# EAGLE schematic ProMini-connection (EAGLE 8.1.0)
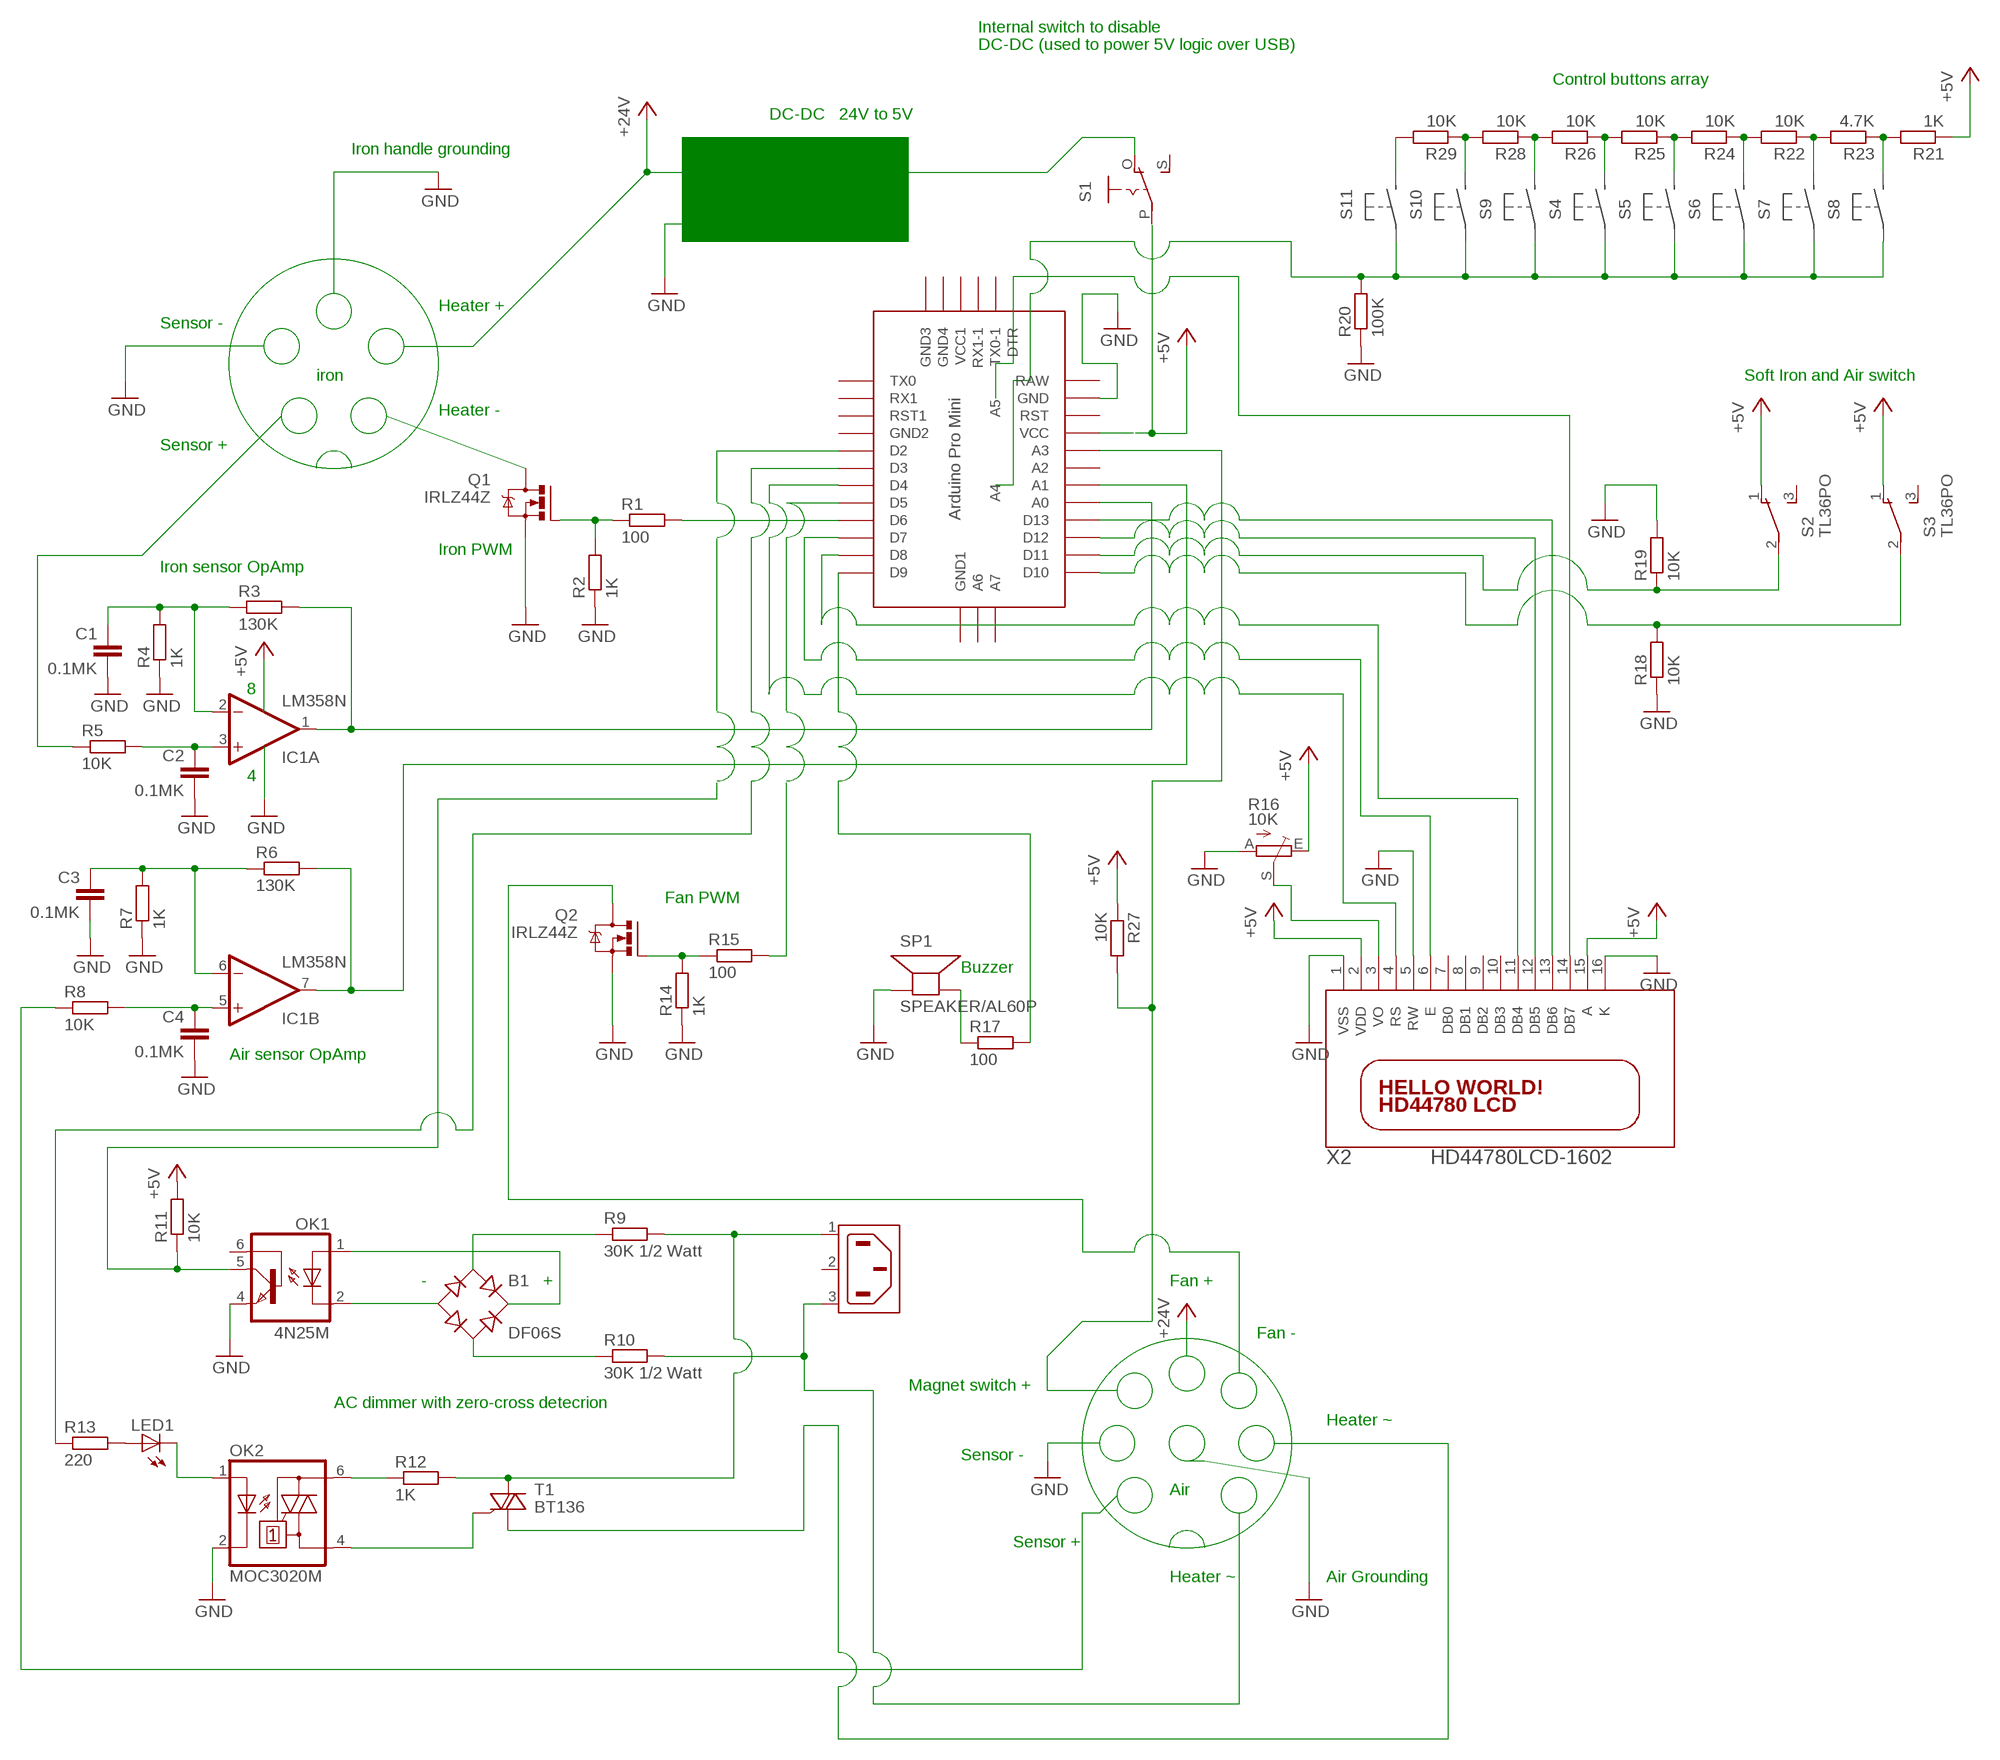
[diagram p0: schematic, sheet 1]

## Parts
B1  DF06S  [DFS]
C1  0.1MK  C-EU025-024X044  [C025-024X044]
C2  0.1MK  C-EU025-024X044  [C025-024X044]
C3  0.1MK  C-EU025-024X044  [C025-024X044]
C4  0.1MK  C-EU025-024X044  [C025-024X044]
IC1  LM358N  [DIL08]
LED1  LED3MM  [LED3MM]
OK1  4N25M  [DIL06]
OK2  MOC3020M  [DIL06]
Q1  IRLZ44Z  [TO220BH]
Q2  IRLZ44Z  [TO220BH]
R1  100  R-EU_0207/7  [0207/7]
R2  1K  R-EU_0207/7  [0207/7]
R3  130K  R-EU_0207/7  [0207/7]
R4  1K  R-EU_0207/7  [0207/7]
R5  10K  R-EU_0207/7  [0207/7]
R6  130K  R-EU_0207/7  [0207/7]
R7  1K  R-EU_0207/7  [0207/7]
R8  10K  R-EU_0207/7  [0207/7]
R9  30K 1/2 Watt  R-EU_0207/7  [0207/7]
R10  30K 1/2 Watt  R-EU_0207/7  [0207/7]
R11  10K  R-EU_0207/7  [0207/7]
R12  1K  R-EU_0207/7  [0207/7]
R13  220  R-EU_0207/7  [0207/7]
R14  1K  R-EU_0207/7  [0207/7]
R15  100  R-EU_0207/7  [0207/7]
R16  10K  TRIM_EU-B64Y  [B64Y]
R17  100  R-EU_0207/7  [0207/7]
R18  10K  R-EU_0207/7  [0207/7]
R19  10K  R-EU_0207/7  [0207/7]
R20  100K  R-EU_0207/7  [0207/7]
R21  1K  R-EU_0207/7  [0207/7]
R22  10K  R-EU_0207/7  [0207/7]
R23  4.7K  R-EU_0207/7  [0207/7]
R24  10K  R-EU_0207/7  [0207/7]
R25  10K  R-EU_0207/7  [0207/7]
R26  10K  R-EU_0207/7  [0207/7]
R27  10K  R-EU_0207/7  [0207/7]
R28  10K  R-EU_0207/7  [0207/7]
R29  10K  R-EU_0207/7  [0207/7]
S1  EG1218S  [EG1218]
S2  TL36PO  [TL3XPO]
S3  TL36PO  [TL3XPO]
SP1  SPEAKER/AL60P  [AL60P]
T1  BT136  [TO220AB]
U$1  ABK-PRO-MINI  [ABK-PRO-MINI]
X1  6ESRM-P  [6ESRM-P]
X2  HD44780LCD-1602  [LCD1602]

## Nets
+5V: R11.2 R16.E R21.1 R27.1 S2.1(O) S3.1(O) X2.2(VDD) X2.15(A) ; supply symbol labelled +24V
GND: C1.2 C2.2 C3.2 C4.2 OK1.4(EMI) OK2.2(C) Q1.S Q2.S R2.1 R4.1 R7.1 R14.1 R16.A R18.1 R19.2 R20.1 SP1.1(+) U$1.GND X2.1(VSS) X2.5(RW) X2.16(K)
N$1: Q1.G R1.1 R2.2
N$2: R1.2 U$1.D6
N$4: Q1.D
N$5: IC1.1(A:OUT) R3.2 U$1.A0
N$6: IC1.7(B:OUT) R6.2 U$1.A1
N$7: C3.1 IC1.6(B:-IN) R6.1 R7.2
N$8: C4.1 IC1.5(B:+IN) R8.2
N$9: C1.1 IC1.2(A:-IN) R3.1 R4.2
N$10: R8.1
N$11: C2.1 IC1.3(A:+IN) R5.2
N$12: R5.1
N$13: B1.AC1 R9.1
N$14: S1.O
N$15: B1.AC2 R10.1
N$16: B1.+ OK1.1(A)
N$17: B1.-
N$18: LED1.A R13.2
N$19: R10.2
N$20: OK1.5(COL) R11.1
N$22: R17.2 U$1.D9
N$24: OK2.6(A2) R12.1
N$25: R9.2 R12.2 T1.2(A2) X1.1(AC1)
N$26: T1.1(A1)
N$27: OK2.4(A1) T1.3(G)
N$28: LED1.K(C) OK2.1(A)
N$31: Q2.G R14.2 R15.1
N$32: U$1.D2
N$33: R15.2
N$34: Q2.D
N$35: U$1.D5
N$37: U$1.D4 X2.4(RS)
N$38: R27.2 U$1.A3
N$39: R17.1 SP1.2(-)
N$40: R13.1 U$1.D3
N$41: R16.S X2.3(VO)
N$42: U$1.D7 X2.6(E)
N$43: R28.2 R29.1
N$44: U$1.VCC
N$45: U$1.D8 X2.11(DB4)
N$46: U$1.D12 X2.12(DB5)
N$47: U$1.D13 X2.13(DB6)
N$48: R29.2
N$50: R20.2
N$51: U$1.D10
N$52: R18.2 R19.1 S2.2(P) S3.2(P) U$1.D11
N$53: R21.2 R23.1
N$54: R22.1 R23.2
N$55: R22.2 R24.1
N$56: R24.2 R25.1
N$57: R25.2 R26.1
N$58: R26.2 R28.1
N$59: X2.14(DB7)
Unconnected: OK1.2(C) OK1.6(BAS) S1.P S1.S S2.3(S) S3.3(S) U$1.A2 U$1.A4 U$1.A5 U$1.A6 U$1.A7 U$1.DTR U$1.GND1(GND2) U$1.GND2(GND3) U$1.GND3(GND4) U$1.GND4(GND1) U$1.RAW U$1.RST U$1.RST1 U$1.RX1 U$1.RX1-1 U$1.TX0 U$1.TX0-1 U$1.VCC1 X1.2(SH) X1.3(AC2) X2.7(DB0) X2.8(DB1) X2.9(DB2) X2.10(DB3)

## Notes on the sheet
- Internal switch to disable
- DC-DC (used to power 5V logic over USB)
- Control buttons array
- DC-DC | 24V to 5V
- Iron handle grounding
- Heater +
- Sensor -
- iron | Soft Iron and Air switch
- Heater -
- Sensor +
- Iron PWM
- Iron sensor OpAmp
- 8
- 4
- Fan PWM
- Buzzer
- Air sensor OpAmp
- - | + | Fan +
- Fan -
- Magnet switch +
- AC dimmer with zero-cross detecrion
- Heater ~
- Sensor -
- Air
- Sensor +
- Heater ~ | Air Grounding

## Power pins joined to a net without a drawn wire
V+: IC1.8(P:V+)
V-: IC1.4(P:V-)

## Library data of the parts
B1 = rectifier:DF*S: Surface Mount Glass Passivated Bridge Rectifiers Source: Source: Comchip Bridge Rectifiers DF005S-G thru DF10S-G.pdf
C1-C4 = resistor:C-EU: CAPACITOR, European symbol
IC1 = linear:LM358: OP AMP also LM158; LM258; LM2904 Source: http://cache.national.com/ds/LM/LM158.pdf
LED1 = led:LED: LED OSRAM: - CHIPLED LG R971, LG N971, LY N971, LG Q971, LY Q971, LO R971, LY R971 LH N974, LH R974 LS Q976, LO Q976, LY Q976 LO Q996 - Hyper CHIPLED LW Q18S LB Q993, LB Q99A, LB R99A - SideLED LS A670, LO A670, LY A670, LG A670, LP A670 LB A673, LV A673, LT A673, LW A673 LH A674 LY A675 LS A676, LA A676, LO A676, LY A676, LW A676 LS A679, LY A679, LG A679 - Hyper Micro SIDELED® LS Y876, LA Y876, LO Y876, LY Y876 LT Y87S - SmartLED LW L88C, LW L88S LB L89C, LB L89S, LG L890 LS L89K, LO L89K, LY L89K LS L896, LA L896, LO L896, LY L896 - TOPLED LS T670, LO T670, LY T670, LG T670, LP T670 LSG T670, LSP T670, LSY T670, LOP T670, LYG T670 LG T671, LOG T671, LSG T671 LB T673, LV T673, LT T673, LW T673 LH T674 LS T676, LA T676, LO T676, LY T676, LB T676, LH T676, LSB T676, LW T676 LB T67C, LV T67C, LT T67C, LS T67K, LO T67K, LY T67K, LW E67C LS E67B, LA E67B, LO E67B, LY E67B, LB E67C, LV E67C, LT E67C LW T67C LS T679, LY T679, LG T679 LS T770, LO T770, LY T770, LG T770, LP T770 LB T773, LV T773, LT T773, LW T773 LH T774 LS E675, LA E675, LY E675, LS T675 LS T776, LA T776, LO T776, LY T776, LB T776 LHGB T686 LT T68C, LB T68C - Hyper Mini TOPLED® LB M676 - Mini TOPLED Santana® LG M470 LS M47K, LO M47K, LY M47K Source: http://www.osram.convergy.de LUXEON: - LUMILED® LXK2-PW12-R00, LXK2-PW12-S00, LXK2-PW14-U00, LXK2-PW14-V00 LXK2-PM12-R00, LXK2-PM12-S00, LXK2-PM14-U00 LXK2-PE12-Q00, LXK2-PE12-R00, LXK2-PE12-S00, LXK2-PE14-T00, LXK2-PE14-U00 LXK2-PB12-K00, LXK2-PB12-L00, LXK2-PB12-M00, LXK2-PB14-N00, LXK2-PB14-P00, LXK2-PB14-Q00 LXK2-PR12-L00, LXK2-PR12-M00, LXK2-PR14-Q00, LXK2-PR14-R00 LXK2-PD12-Q00, LXK2-PD12-R00, LXK2-PD12-S00 LXK2-PH12-R00, LXK2-PH12-S00 LXK2-PL12-P00, LXK2-PL12-Q00, LXK2-PL12-R00 Source: www.luxeon.com KINGBRIGHT: KA-3528ASYC Source: www.kingbright.com
OK1 = optocoupler:4N*?M: General Purpose 6-Pin Phototransistor Optocouplers Source: http://www.fairchildsemi.com/ds/4N/4N35-M.pdf; MPN: 4N25-M; OC_FARNELL: 1021349; OC_NEWARK: 98K9084
OK2 = optocoupler:MOC30*M: RANDOM-PHASE OPTOISOLATORS TRIAC DRIVER OUTPUT Source: http://www.fairchildsemi.com MOC3020-M.pdf; MF: FAIRCHILD SEMICONDUCTOR; MPN: MOC3020-M; OC_FARNELL: 1505425; OC_NEWARK: 72K8895
Q1 Q2 = transistor-power:IRLZ44Z: N-Channel HEXFET® Power MOSFET Logic Level AUTOMOTIVE MOSFET Source: http://www.irf.com/product-info/datasheets/data/irlz44zpbf.pdf
R1-R15 R17-R29 = resistor:R-EU_: RESISTOR, European symbol
R16 = pot:TRIM_EU-: POTENTIOMETER
S1 = adafruit:EG1218: SLIDING SWITCH 0.1" spacing through hole, vertical SPDT slide switch http://www.ladyada.net/library/pcb/eaglelibrary.html
S2 S3 = switch:TL36PO: TINY SWITCH ON - ON Source: http://www2.produktinfo.conrad.com/datenblaetter/700000-724999/705152-da-01-de-Subminiaturschalter_TL_36YO.pdf
SP1 = adafruit:SPEAKER: SPEAKER Source: Buerklin Added PS12 (for part # PS1240 piezo) http://www.ladyada.net/library/pcb/eaglelibrary.html
T1 = triac:BT136: Triac BT136 series E sensitive gate Source: http://www.nxp.com/acrobat_download/datasheets/BT136_SERIES_E_2.pdf
U$1 = Arduino-clone:ABK-PRO-MINI: ABK Pro-Mini Arduino Clone
X1 = con-tycoelectronics:6ESRM-P: AC Connector 120/250 VAC Source: http://catalog.tycoelectronics.com .. ENG_DS_1654001_1099_SR_0406.pdf; MF: TYCO ELECTRONICS; MPN: 6ESRM-P; OC_FARNELL: unknown; OC_NEWARK: 87F1821
X2 = adafruit:HD44780LCD: HD44780 LCD Standard character type LCDs, available in sizes from 8x1 to 40x4!